# Altium schematic sheet FPGA_165A_CAN_Receiver.SchDoc
size B; Organization: Altium Limited; Address1: L3, 12a Rodborough Rd; Address2: Frenchs Forest; Address3: NSW; Address4: Australia 2086; DocumentNumber: 1; SheetNumber: 1; SheetTotal: 2
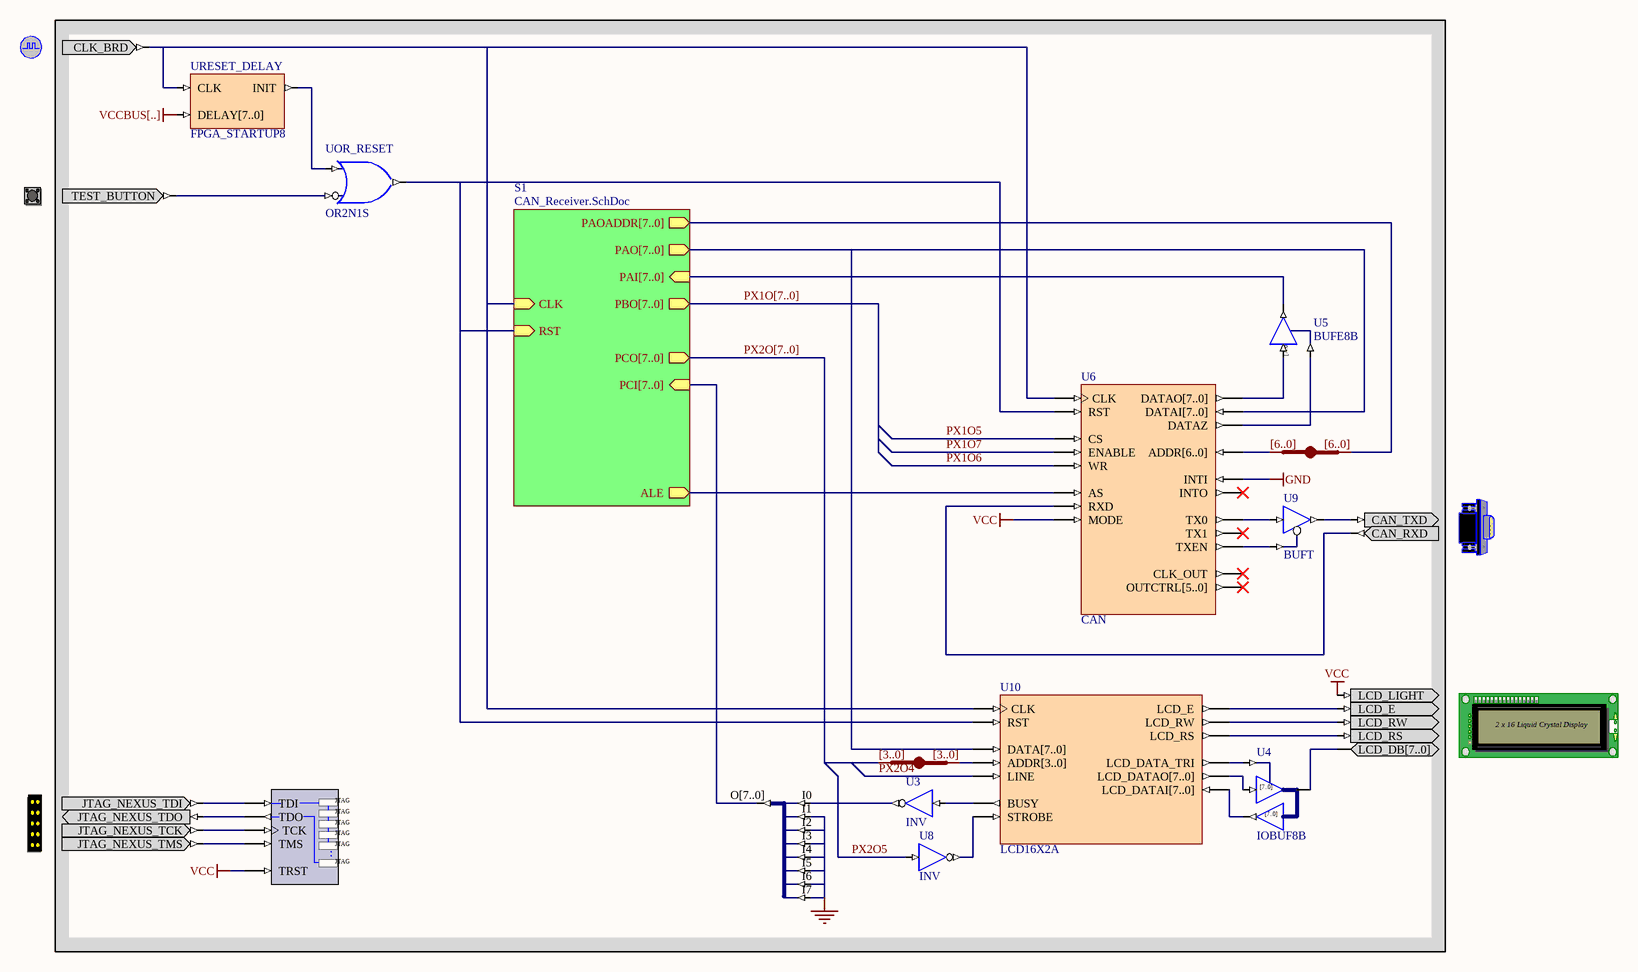
[diagram p0: FPGA_165A_CAN_Receiver.SchDoc]

## Parts
(Parts that share a designator on the sheet are numbered #1, #2 ... from top to bottom, then left to right.)
?#1  CLOCK_BOARD  (value not drawn)
?#2  TEST_BUTTON  (value not drawn)
?#3  CANCNTR  (value not drawn)
?#4  LCD  (value not drawn)
?#5  NEXUS_JTAG_CONNECTOR  (value not drawn)
NEXUS_JTAG_PORT  NEXUS_JTAG_PORT  (value not drawn)
U3  INV
U4  IOBUF8B
U5  BUFE8B
U6  CAN
U7#1  IndexA: [6..0]  (hidden comment: JB)
U7#2  J8S_8B  (value not drawn)
U8#1  IndexA: [3..0]  (hidden comment: JB)
U8#2  INV
U9  BUFT
U10  LCD16X2A
UOR_RESET  OR2N1S
URESET_DELAY  FPGA_STARTUP8

## Sub-sheets
S1 = CAN_Receiver.SchDoc: ALE (out), PAOADDR[7..0] (out), PAI[7..0] (in), PCI[7..0] (in), PAO[7..0] (out), PBO[7..0] (out), PCO[7..0] (out), RST (in), CLK (in)

## Nets
GND: U6.INTI U7#2.I1 U7#2.I2 U7#2.I3 U7#2.I4 U7#2.I5 U7#2.I6 U7#2.I7
VCC: ?#4.LCD_LIGHT NEXUS_JTAG_PORT.TRST U6.MODE
VCCBUS[..]: URESET_DELAY.DELAY[7..0]
PX1O5: U6.CS
PX1O6: U6.WR
PX1O7: U6.ENABLE
PX2O4: U10.LINE
PX2O5: U8#2.I
PX2O[7..0]: U8#1.A[0..0] ; sheet S1/PCO[7..0]
Net?#1_CLK_BRD: ?#1.CLK_BRD U6.CLK U10.CLK URESET_DELAY.CLK ; sheet S1/CLK
Net?#2_TEST_BUTTON: ?#2.TEST_BUTTON UOR_RESET.I0
Net?#3_CAN_RXD: ?#3.CAN_RXD U6.RXD
Net?#3_CAN_TXD: ?#3.CAN_TXD U9.O(Y)
Net?#4_LCD_DB[7..0]: ?#4.LCD_DB[7..0] U4.IO[7..0]
Net?#4_LCD_E: ?#4.LCD_E U10.LCD_E
Net?#4_LCD_RS: ?#4.LCD_RS U10.LCD_RS
Net?#4_LCD_RW: ?#4.LCD_RW U10.LCD_RW
Net?#5_JTAG_NEXUS_TCK: ?#5.JTAG_NEXUS_TCK NEXUS_JTAG_PORT.TCK
Net?#5_JTAG_NEXUS_TDI: ?#5.JTAG_NEXUS_TDI NEXUS_JTAG_PORT.TDI
Net?#5_JTAG_NEXUS_TDO: ?#5.JTAG_NEXUS_TDO NEXUS_JTAG_PORT.TDO
Net?#5_JTAG_NEXUS_TMS: ?#5.JTAG_NEXUS_TMS NEXUS_JTAG_PORT.TMS
NetU3_I: U3.I U10.BUSY
NetU3_O: U3.O U7#2.I0
NetU4_I[7..0]: U4.I[7..0] U10.LCD_DATAO[7..0]
NetU4_O[7..0]: U4.O[7..0] U10.LCD_DATAI[7..0]
NetU4_T: U4.T U10.LCD_DATA_TRI
NetU5_E: U5.E U6.DATAZ
NetU5_I[7..0]: U5.I[7..0] U6.DATAO[7..0]
NetU5_O[7..0]: U5.O[7..0] ; sheet S1/PAI[7..0]
NetU6_ADDR[6..0]: U6.ADDR[6..0] U7#1.B[0..0]
NetU6_AS: U6.AS ; sheet S1/ALE
NetU6_DATAI[7..0]: U6.DATAI[7..0] U10.DATA[7..0] ; sheet S1/PAO[7..0]
NetU6_RST: U6.RST U10.RST UOR_RESET.O ; sheet S1/RST
NetU6_TX0: U6.TX0 U9.I
NetU6_TXEN: U6.TXEN U9.T
NetU7#1_A[0..0]: U7#1.A[0..0] ; sheet S1/PAOADDR[7..0]
NetU7#2_O[7..0]: U7#2.O[7..0] ; sheet S1/PCI[7..0]
NetU8#1_B[0..0]: U8#1.B[0..0] U10.ADDR[3..0]
NetU8#2_O: U8#2.O U10.STROBE
NetUOR_RESET_I1: UOR_RESET.I1 URESET_DELAY.INIT

Not connected (* = marked no-connect by the designer): U6 CLK_OUT* INTO* OUTCTRL[5..0]* TX1*

## Buses and harness runs
bus PX1O[7..0] = sheet S1/PBO[7..0]
bus PX2O[7..0] = sheet S1/PCO[7..0]

## Notes on the sheet
- Title
- Size:
- Date:
- B
- Number:
- Time:
- Revision:
- Sheet
- of
- File:
- (in symbol BUFE8B) [7..0]
- (in symbol IOBUF8B) [7..0]
- (in symbol LCD) 2 x 16 Liquid Crystal Display
- (in symbol NEXUS_JTAG_PORT) JTAG; .

## Library data of the parts
?#1 = CLOCK_BOARD: Global System Clock Supply; PortComponent: True; Published: 19-Nov-2003; Publisher: Altium Limited
?#2 = TEST_BUTTON: Test Button; PortComponent: True; Published: 19-Nov-2003; Publisher: Altium Limited
?#3 = CANCNTR: CAN Bus Connector; PortComponent: True; Published: 19-Nov-2003; Publisher: Altium Limited
?#4 = LCD: Liquid Crystal Display; PortComponent: True; Published: 19-Nov-2003; Publisher: Altium Limited
?#5 = NEXUS_JTAG_CONNECTOR: JTAG Port; PortComponent: True; Published: 19-Nov-2003; Publisher: Altium Limited
NEXUS_JTAG_PORT = NEXUS_JTAG_PORT: Soft Nexus-Chain Connector; NEXUS_JTAG_CONNECTOR: True; Published: 18-Dec-2003; Publisher: Altium Limited
U3 U8#2 = INV: Inverter; ArchiveName: GENERIC; VHDLIB_SIM: GENERIC_LIB; Published: 28-Jan-2004; Publisher: Altium Limited; Xilinx Equivalent: INV; Core Revision: 1.00.00
U4 = IOBUF8B: 8-Bit Input/Output Buffer, Bus Version; ArchiveName: GENERIC; Published: 18-Dec-2003; Publisher: Altium Limited; Core Revision: 1.00.00
U5 = BUFE8B: 8-Bit 3-state Buffer with Active High Enable, Bus Version; Xilinx Equivalent: BUFE8; ArchiveName: GENERIC; Published: 18-Nov-2003; Publisher: Altium Limited; Core Revision: 1.00.00
U6 = CAN: CAN Controller; ChildModel1: CAN10000_DRAM8X64; Published: 18/12/2003; Publisher: Altium Hobart Technology Centre; Core Revision: 1.00.00
U7#1 U8#1 = JB: System BUS Joiner; ArchiveName: GENERIC; Published: 18-Dec-2003; Publisher: Altium Limited; Core Revision: 1.00.00
  U7#1: IndexB: [6..0]
  U8#1: IndexB: [3..0]
U7#2 = J8S_8B: 8 Single pin inputs to single 8-Bit output bus; ArchiveName: GENERIC; Published: 18-Dec-2003; Publisher: Altium Limited; Core Revision: 1.00.00
U9 = BUFT: 1-Bit 3-state Buffer with Active Low Enable; ArchiveName: GENERIC; Published: 18-Nov-2003; Publisher: Altium Limited; Xilinx Equivalent: BUFT; Core Revision: 1.00.00
U10 = LCD16X2A: LCD Controller; Published: 5/01/2004; Publisher: Altium Hobart Technology Centre; Core Revision: 1.00.00
UOR_RESET = OR2N1S: 2-Input OR Gate with Active Low A Input, Single Pin Version; Xilinx Equivalent: OR2B1; ArchiveName: GENERIC; Published: 18-Dec-2003; Publisher: Altium Limited; Core Revision: 1.00.00
URESET_DELAY = FPGA_STARTUP8: FPGA Startup With 8 Bit Delay; Published: 21/01/2004; Publisher: Altium Hobart Technology Centre; Core Revision: 1.00.00